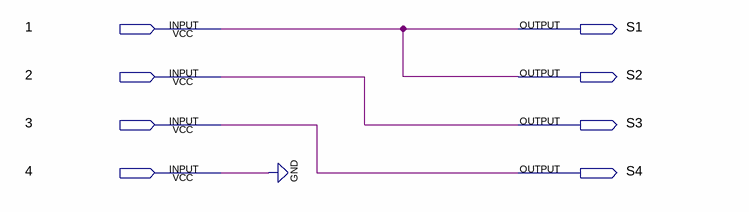
[diagram p0: schematic sheet]
// Quartus schematic shift-right1.bdf as structural Verilog: 0 symbols, 8 pins
module \shift-right1  (
  input  \1 ,
  input  \2 ,
  input  \3 ,
  input  \4 ,
  output S1,
  output S2,
  output S3,
  output S4
);


  assign S1 = \1 ;
  assign S2 = \1 ;
  assign S3 = \2 ;
  assign S4 = \3 ;
  // also tied to GND on the sheet: \4 
endmodule
